# Altium schematic sheet 便携T12烙铁.SchDoc
size A4
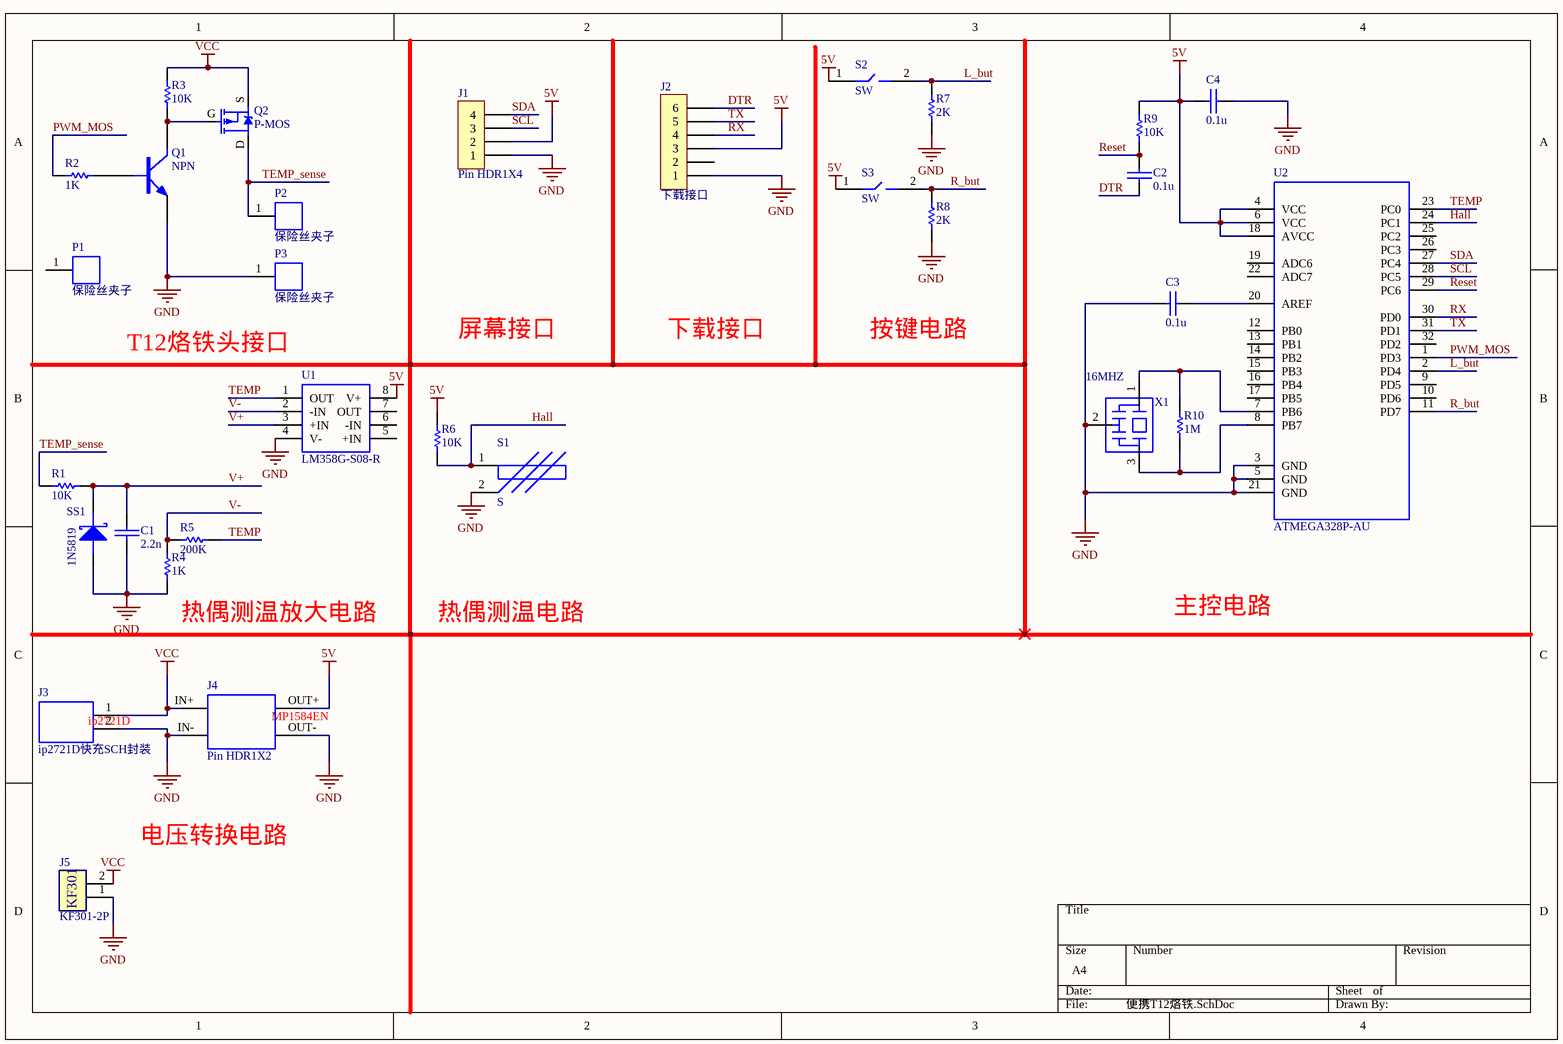
[diagram p0: 便携T12烙铁.SchDoc]

## Parts
C1  2.2n  [0603C]
C2  0.1u  [0603C]
C3  0.1u  [0603C]
C4  0.1u  [0603C]
J1  Pin HDR1X4  [Pin HDR1X4/2.54mm-S]
J2  下载接口  [Pin HDR1X6/2.54mm-S]
J3  ip2721D快充SCH封装  [ip2721D快充PCB封装]
J4  Pin HDR1X2  [MP1584EN稳压PCB封装]
J5  KF301-2P  [KF301-5.0-2P]
P1  保险丝夹子  [FUSE-5x20]
P2  保险丝夹子  [FUSE-5x20]
P3  保险丝夹子  [FUSE-5x20]
Q1  NPN  [SOT-23]
Q2  P-MOS  [TO263-3B]
R1  10K  [0603R]
R2  1K  [0603R]
R3  10K  [0805R]
R4  1K  [0603R]
R5  200K  [0603R]
R6  10K  [0603R]
R7  2K  [0603R]
R8  2K  [0603R]
R9  10K  [0603R]
R10  1M  [0603R]
S1  S  [S]
S2  SW  [TSW 3*6*4.3-S-W]
S3  SW  [TSW 3*6*4.3-S-W]
SS1  1N5819  [SMA/DO-214AC]
U1  LM358G-S08-R  [SOP8]
U2  ATMEGA328P-AU  [TQFP32 7x7_M]
X1  16MHZ  [晶振3213]

## Nets
5V: C4.1 J1.2 J2.3 J4.OUT+ R6.2 R9.2 S2.1(A1) S3.1(A1) U1.8(V+) U2.4(VCC) U2.6(VCC) U2.18(AVCC)
GND: C1.1 C3.2 C4.2 J1.1 J2.1 J3.2(-) J4.IN- J4.OUT- J5.1 P3.1 Q1.E R4.2 R7.1 R8.1 S1.2 SS1.A U1.4(V-) U2.3(GND) U2.5(GND) U2.21(GND) X1.2
VCC: J3.1(+) J4.IN+ J5.2 Q2.S R3.2
DTR: C2.1 J2.6
Hall: R6.1 S1.1 U2.24(PC1)
L_but: R7.2 S2.2 U2.2(PD4)
PWM_MOS: R2.2 U2.1(PD3)
R_but: R8.2 S3.2 U2.11(PD7)
Reset: C2.2 R9.1 U2.29(PC6)
RX: J2.4 U2.30(PD0)
SCL: J1.3 U2.28(PC5)
SDA: J1.4 U2.27(PC4)
TEMP: R5.1 U1.1(OUT) U2.23(PC0)
TEMP_sense: P2.1 Q2.D R1.1
TX: J2.5 U2.31(PD1)
V+: C1.2 R1.2 SS1.K U1.3(+IN)
V-: R4.1 R5.2 U1.2(-IN)
NetC3_1: C3.1 U2.20(AREF)
NetQ1_B: Q1.B R2.1
NetQ1_C: Q1.C Q2.G R3.1
NetR10_1: R10.1 U2.8(PB7) X1.3
NetR10_2: R10.2 U2.7(PB6) X1.1

Not connected (* = marked no-connect by the designer): J2 2; P1 1; U1 5(+IN) 6(-IN) 7(OUT); U2 9(PD5) 10(PD6) 12(PB0) 13(PB1) 14(PB2) 15(PB3) 16(PB4) 17(PB5) 19(ADC6) 22(ADC7) 25(PC2) 26(PC3) 32(PD2)

## Notes on the sheet
- T12烙铁头接口
- 屏幕接口
- 下载接口
- 按键电路
- (near R4) 热偶测温放大电路
- 热偶测温电路
- 主控电路
- 电压转换电路
- (in symbol ip2721D快充SCH封装) ip2721D
- (in symbol KF301-2P) KF301
- (in symbol MP1584EN稳压SCH封装) MP1584EN

## Library data of the parts
C1-C4 = CAP: 无极性电容
J1 = Pin HDR1X4: 0.91 i2c oled
J2 = Pin HDR1X6
J4 = MP1584EN稳压SCH封装
P1-P3 = 保险丝夹子: 保险丝夹子 / 5X20
Q1 = NPN: NPN三极管 / 2SC3356-T1B-A
Q2 = P-MOS: P沟道场效应管 / IRF4905STRLPBF
R1-R10 = RES: 电阻
S1 = S: 震动开关 / SW180  建议SW18015
S2 S3 = SW: 侧立按键开关 / 3*6*4.3
SS1 = DIODE SCHOTTKY: 肖特基二极管SS12
U1 = LM358G-S08-R: 运放
X1 = 晶振3213